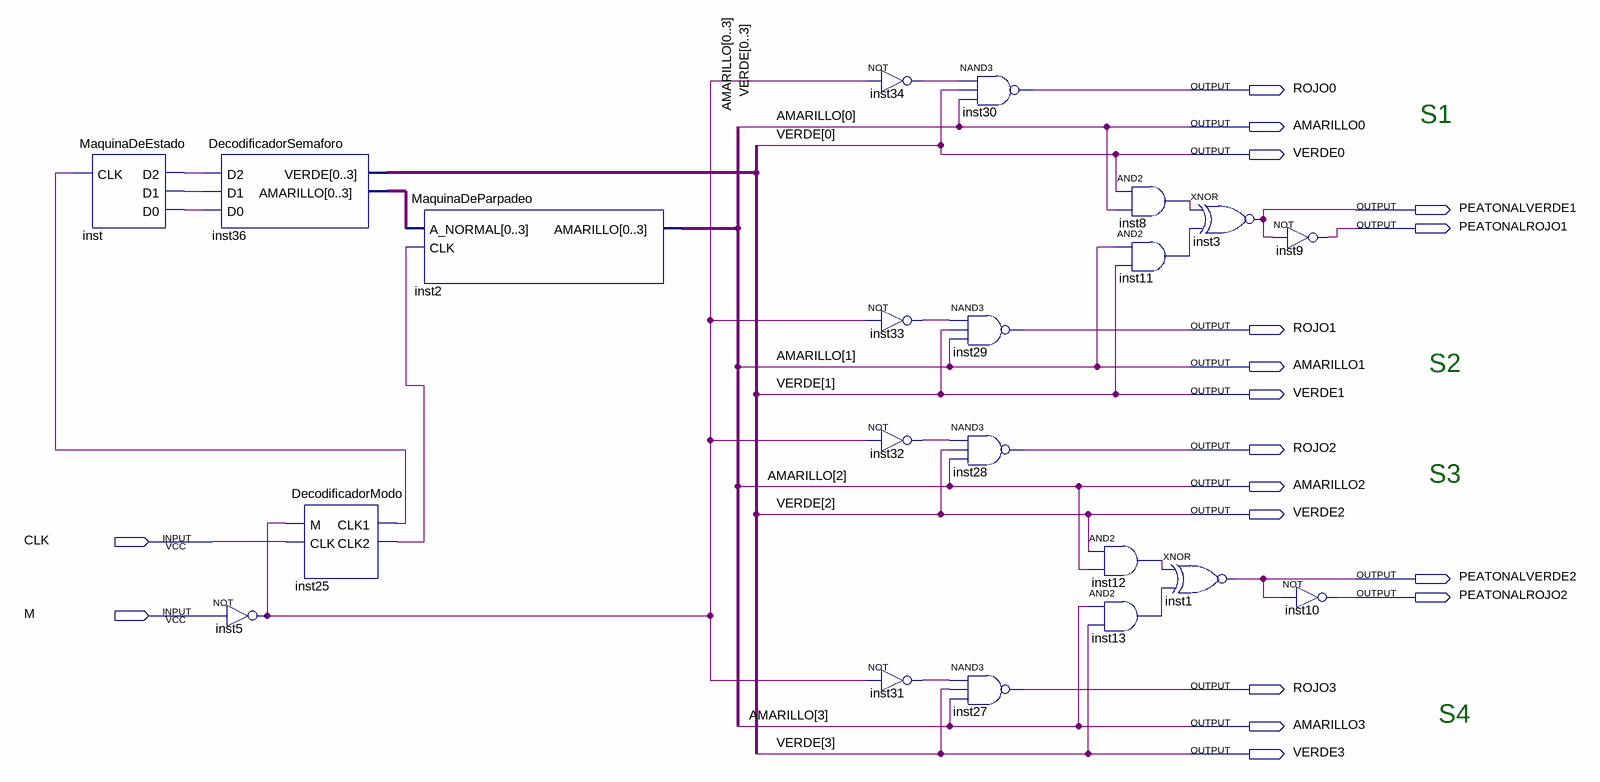
[diagram p0: schematic sheet]
// Quartus schematic Tp2Grupo3.bdf as structural Verilog: 21 symbols, 18 pins
module Tp2Grupo3 (
  input  CLK,
  input  M,
  output ROJO0,
  output AMARILLO0,
  output VERDE0,
  output PEATONALVERDE1,
  output PEATONALROJO1,
  output ROJO1,
  output AMARILLO1,
  output VERDE1,
  output ROJO2,
  output AMARILLO2,
  output VERDE2,
  output PEATONALVERDE2,
  output PEATONALROJO2,
  output ROJO3,
  output AMARILLO3,
  output VERDE3
);

  wire inst5_out, inst8_out, inst11_out, inst12_out, inst13_out, inst25_clk1, inst25_clk2, inst31_out,
       inst32_out, inst33_out, inst34_out, inst_d0, inst_d1, inst_d2;
  wire [3:0] inst36_amarillo;

  MaquinaDeEstado inst (.CLK(inst25_clk1), .D2(inst_d2), .D1(inst_d1), .D0(inst_d0));
  DecodificadorSemaforo inst36 (
    .D2(inst_d2), .D1(inst_d1), .D0(inst_d0), .VERDE({VERDE0, VERDE1, VERDE2, VERDE3}),
    .AMARILLO(inst36_amarillo));
  not inst5 (inst5_out, M);
  DecodificadorModo inst25 (.M(inst5_out), .CLK(CLK), .CLK1(inst25_clk1), .CLK2(inst25_clk2));
  MaquinaDeParpadeo inst2 (
    .A_NORMAL(inst36_amarillo), .CLK(inst25_clk2), .AMARILLO({AMARILLO0, AMARILLO1, AMARILLO2, AMARILLO3}));
  not inst34 (inst34_out, inst5_out);
  not inst33 (inst33_out, inst5_out);
  not inst32 (inst32_out, inst5_out);
  not inst31 (inst31_out, inst5_out);
  nand inst30 (ROJO0, inst34_out, VERDE0, AMARILLO0);
  nand inst29 (ROJO1, inst33_out, VERDE1, AMARILLO1);
  nand inst28 (ROJO2, inst32_out, VERDE2, AMARILLO2);
  nand inst27 (ROJO3, inst31_out, VERDE3, AMARILLO3);
  and inst12 (inst12_out, VERDE2, AMARILLO2);
  and inst13 (inst13_out, AMARILLO3, VERDE3);
  and inst8 (inst8_out, VERDE0, AMARILLO0);
  and inst11 (inst11_out, AMARILLO1, VERDE1);
  xnor inst1 (PEATONALVERDE2, inst12_out, inst13_out);
  xnor inst3 (PEATONALVERDE1, inst8_out, inst11_out);
  not inst9 (PEATONALROJO1, PEATONALVERDE1);
  not inst10 (PEATONALROJO2, PEATONALVERDE2);

  // Notes on the sheet:
  //   S1
  //   S2
  //   S3
  //   S4
endmodule
